# Altium project _A_D.000000.001.PrjPCB
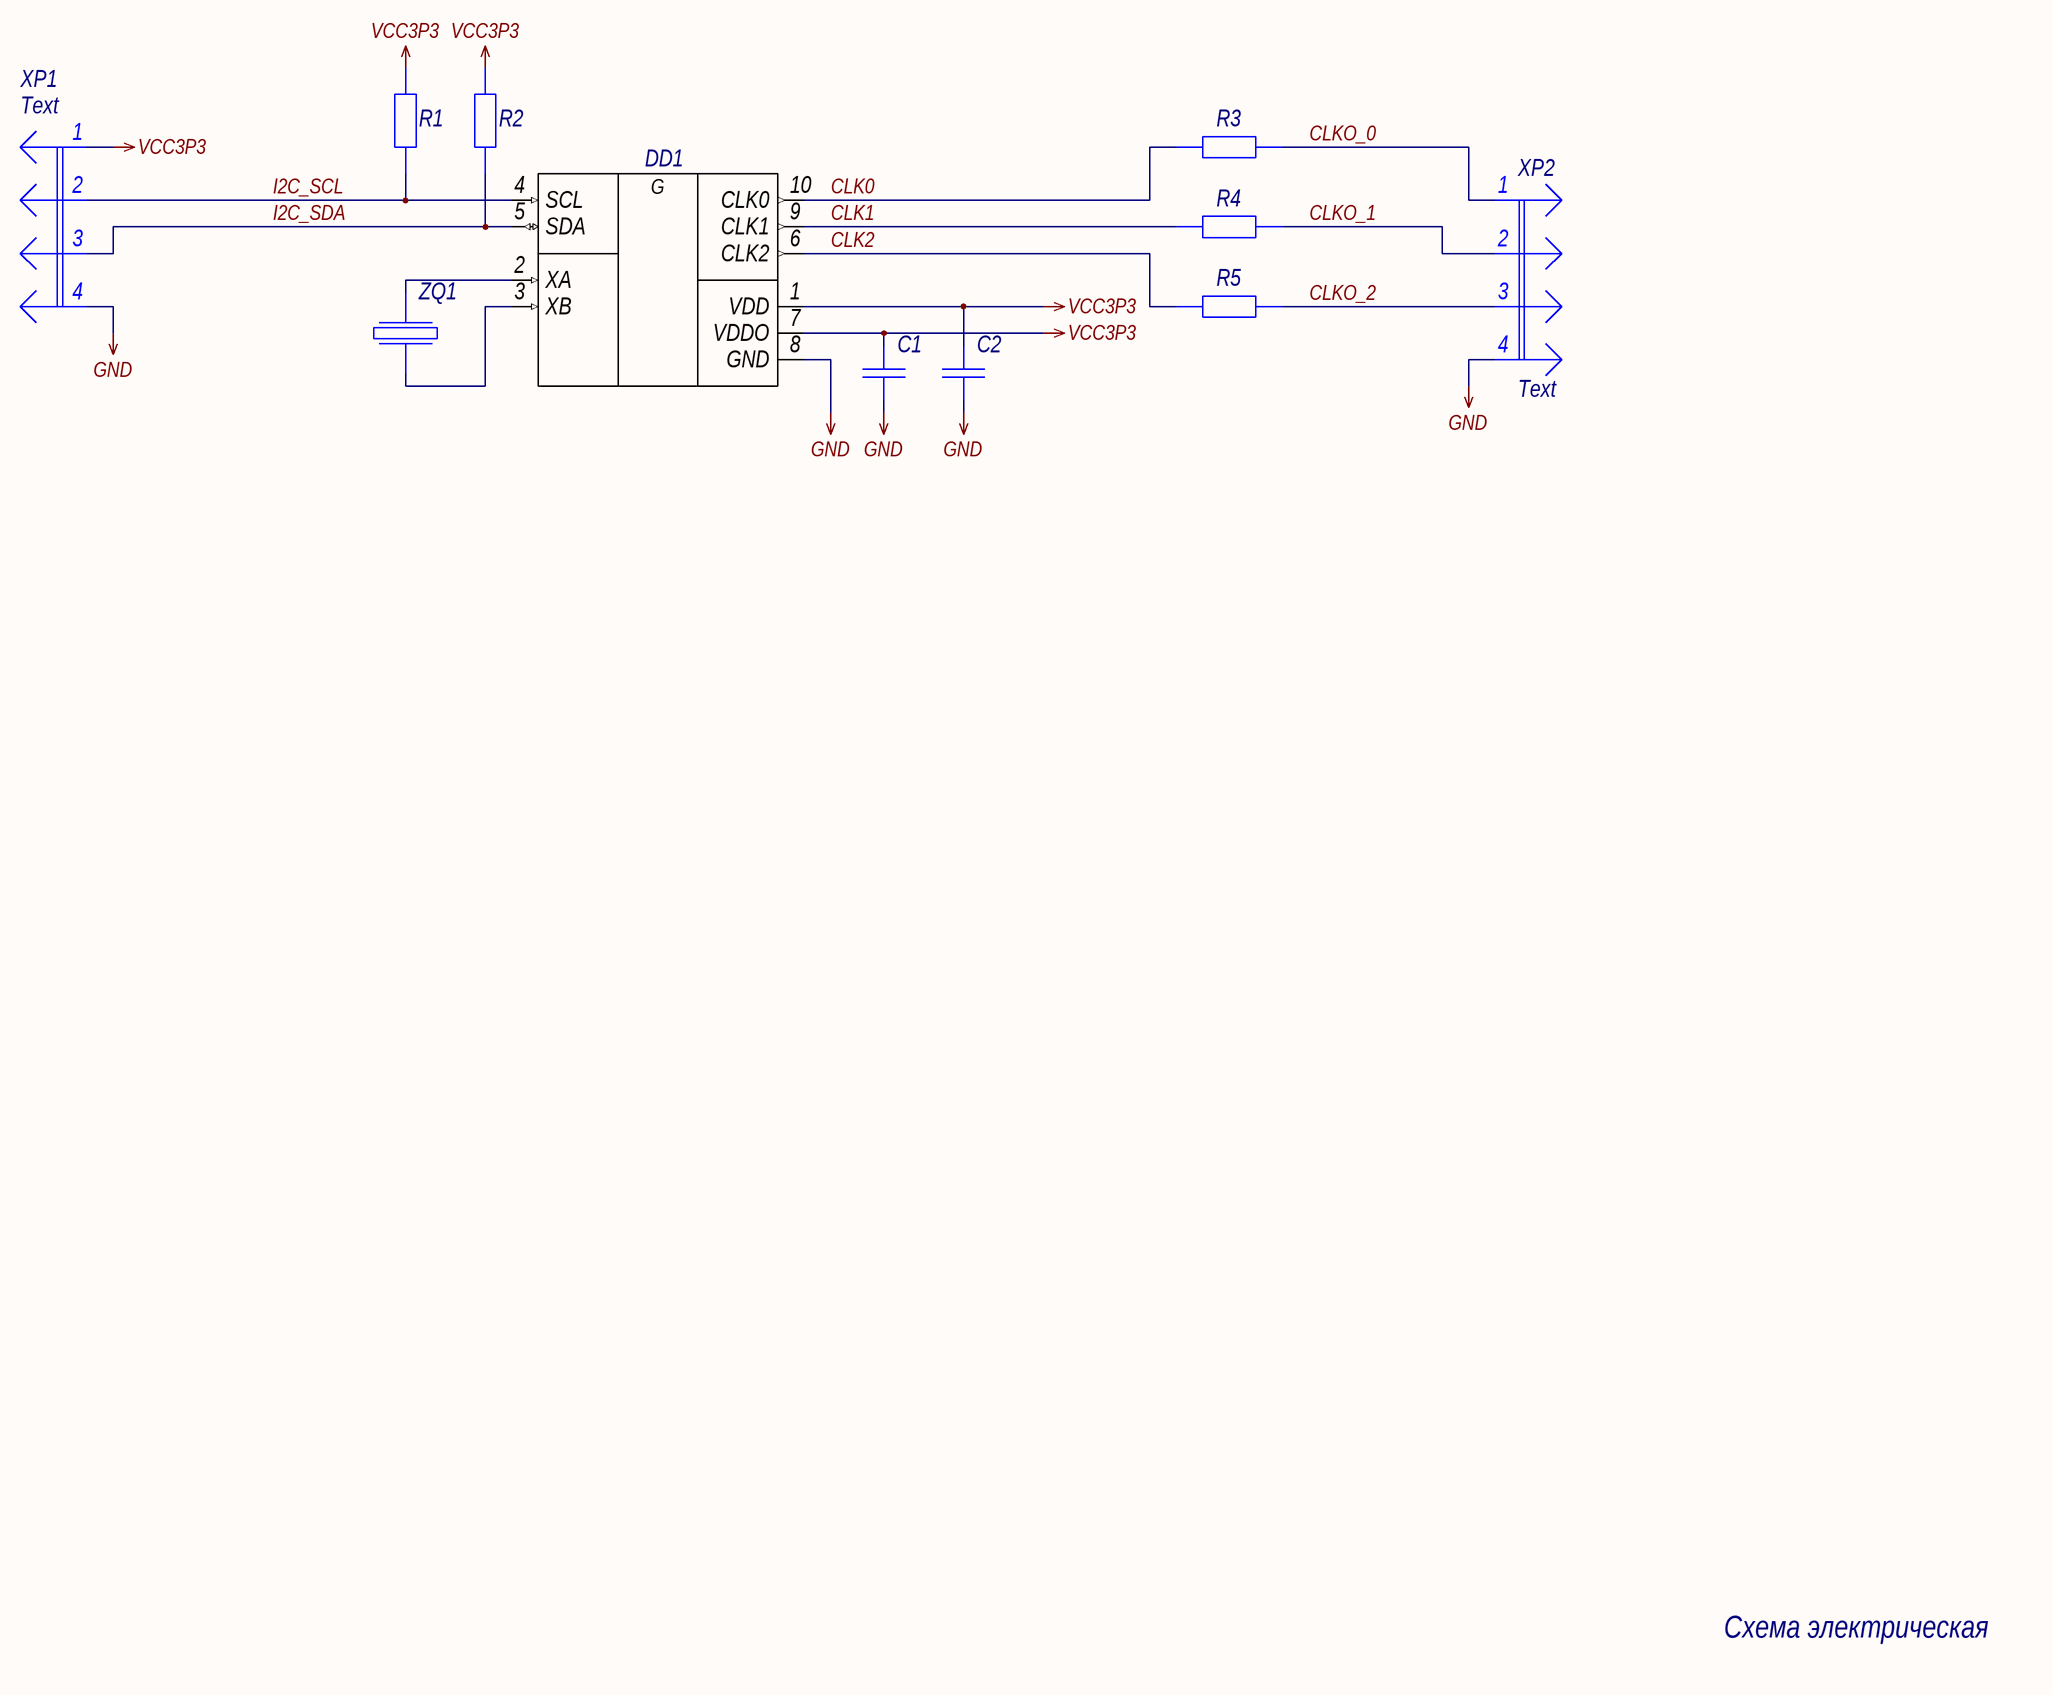
[diagram p0: A_D.000000.001.SchDoc]
GlobalProjectRevision: 1; GlobalProjectNumber: A_D.000000.001; GlobalProjectName: Si5351A Pinout; GlobalOrganizationName: A_D Electronics
1 sheet, 11 parts. Net scope: hierarchical (ports join the sheet entries above them; power ports are global).
Board file: A_D.000000.001.PcbDoc

## Sheet A_D.000000.001.SchDoc: =GlobalProjectName
size 594 x 420 mm; CheckedBy: A_D; Author: A_D; Organization: A_D Electronics; DocumentNumber: A_D.000000.001 Э3; Revision: 1; SheetTotal: 1; PageSetup: Record=PageOptions|CenterHorizontal=True|CenterVertical=True|PrintScale=0.70|XCorrection=1.00|YCorrection=1.00|PrintKind=2|BorderSize=5000000|LeftOffset=9000|BottomOffset=10100|Orientation=2|PaperLength=11176|PaperWidth=8636|Scale=100|PaperSource=259|PrintQuality=-3|MediaType=1|DitherType=10|PrintScaleMode=1|PaperKind=A3|PaperIndex=8; FirstApplication: A_D.000000.001; DocumentName: Si5351A Pinout

### Parts
C1  Capacitor  [C0603_L]  (value not drawn)
C2  Capacitor  [C0603_L]  (value not drawn)
DD1  Si5351x-x-GT  [MSOP-10]  (value not drawn)
R1  Resistor  [R0603_L]  (value not drawn)
R2  Resistor  [R0603_L]  (value not drawn)
R3  Resistor  [R0603_L]  (value not drawn)
R4  Resistor  [R0603_L]  (value not drawn)
R5  Resistor  [R0603_L]  (value not drawn)
XP1  Text  [PLS-4]
XP2  Text  [PLS-4]
ZQ1  Crystal-1_3p  [SMD 3.2x2.5mm]  (value not drawn)

### Nets
GND: C1.1 C2.1 DD1.8(GND) XP1.4 XP2.4
VCC3P3: C1.2 C2.2 DD1.1(VDD) DD1.7(VDDO) R1.2 R2.2 XP1.1
CLK0: DD1.10(CLK0) R3.1
CLK1: DD1.9(CLK1) R4.1
CLK2: DD1.6(CLK2) R5.1
CLKO_0: R3.2 XP2.1
CLKO_1: R4.2 XP2.2
CLKO_2: R5.2 XP2.3
I2C_SCL: DD1.4(SCL) R1.1 XP1.2
I2C_SDA: DD1.5(SDA) R2.1 XP1.3
NetDD1_2: DD1.2(XA) ZQ1.1
NetDD1_3: DD1.3(XB) ZQ1.3

### Notes on the sheet
- Схема электрическая
  принципиальная
- Перв. примен.
- Справ. №
- ПЗ:                             Дата
- Подп. и дата
- Инв. № дубл.
- Взам. инв. №
- Разраб.
- Изм.
- Лист
- № докум.
- Подп.
- Дата
- Литера
- Масса
- Масштаб
- Пров.
- Т.контр.
- Листов
- Инв. № подл.
- Н.контр.
- Утв.
- Форма 1 ГОСТ 2.104-2006
- Копировал
- Формат А2
- (in symbol Si5351A-B-GT) G

### Library data of the parts
C1 = GRM188R61C225KE15D: Manufacturer: Murata; Type: Конденсатор; ID: 152; Value: 2.2uF; Voltage: 16V; Tolerance: ±10%; Dielectric Type: X5R; Application Category: 1; Working Temperature Min: -55°С; Working Temperature Max: +85°С; Published: 18.05.2010; Publisher: Andrew Danich; Part Number: GRM188R61C225KE15D; Footprint: 0603
C2 = GRM188R71E104KA01D: Manufacturer: Murata; Type: Конденсатор; ID: 228; Value: 0.1uF; Voltage: 25V; Tolerance: ±10%; Dielectric Type: X7R; Application Category: 1; Working Temperature Min: -55°С; Working Temperature Max: +125°С; Published: 18.05.2010; Publisher: Andrew Danich; Part Number: GRM188R71E104KA01D; Footprint: 0603
DD1 = Si5351A-B-GT: Manufacturer: Silicon Labs; ID: 3; Supply Operation: +3.0…3.6V; Supply Current: 35mA; Output Impedance: 50ohm; Rise\Fall Time: 1.5ns\1.5ns; Series Type: I2C Prog CMOS Clock Generator; Bandwidth: 200MHz; Application Category: 1; Working Temperature Min: -40°С; Working Temperature Max: +85°С; Functional Analog: Si5351A-B-GTR; Published: 10.06.2018; Type: Микросхема; Publisher: Andrew Danich; Part Number: Si5351A-B-GT; Value: Si5351A-B-GT; Propagation Delay: -
R1 R2 = RC0603JR-074K7L: Manufacturer: Yageo; ID: 56; Value: 4.7k; Limit Voltage: 50V; Tolerance: ±5%; Temperature Coefficient: 100ppm; Total Power Dissipation: 0.1W; Series Type: Thick-Film; Application Category: 1; Working Temperature Min: -55°С; Working Temperature Max: +155°С; Published: 24.03.2010; Publisher: Andrew Danich; Type: Резистор; Part Number: RC0603JR-074K7L; Footprint: 0603
R3-R5 = RC0603JR-070R: Manufacturer: Yageo; ID: 5; Value: 0; Limit Voltage: 50V; Tolerance: ±5%; Temperature Coefficient: 100ppm; Total Power Dissipation: 0.1W; Series Type: Thick-Film; Application Category: 1; Working Temperature Min: -55°С; Working Temperature Max: +155°С; Functional Analog: RC0603FR-070RL, CR0603-J/-000E; Published: 24.03.2010; Publisher: Andrew Danich; Type: Резистор; Part Number: RC0603JR-070R; Footprint: 0603
XP1 XP2 = PLS-4: Value: PLS-4; ID: 3; Limit Voltage: 250V; Limit Current: 3A; Connector Type: Male; Resistance: 15momh; Surface Finish: Gold; Pitch: 2.54mm; Published: 07.03.2013; Publisher: Andrew Danich; Type: Вилка; Part Number: PLS-4; Pins: 4
ZQ1 = 12.88667_KX-7-25.0MHz: Manufacturer: GEYER ELECTRONIC; ID: 22; Output Frequency: 25МГц; Load Capacitance: 10pF; Temperature Coefficient: ±50ppm; Application Category: 1; Working Temperature Min: -20°С; Working Temperature Max: +70°С; Published: 12.09.2014; Publisher: Andrew Danich; Type: Резонатор; Part Number: 12.88667_KX-7-25.0MHz; Value: 12.88667_KX-7-25.0MHz; Functional Analog: -